# EAGLE design POIstick (EAGLE 8.3.2)
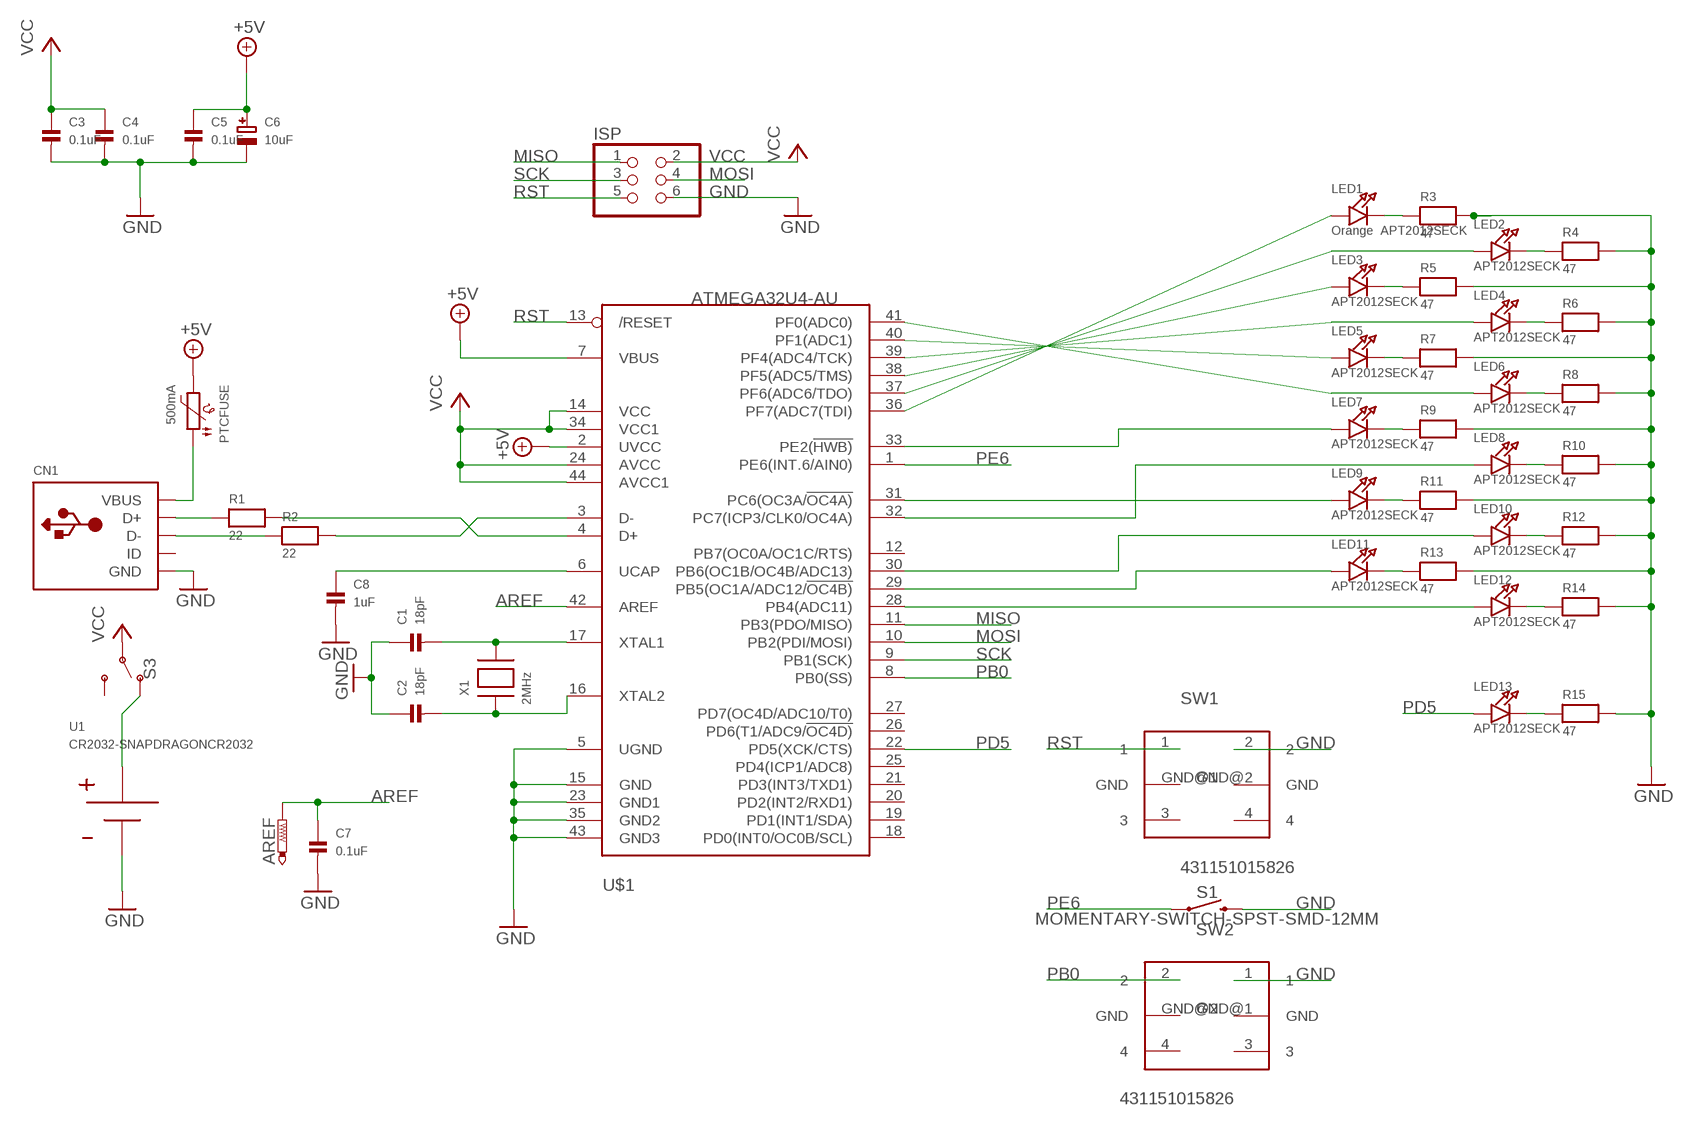
[diagram p0: schematic, sheet 1]

## Parts
AREF  PTR1B1,27  [B1,27]
C1  18pF  CAP_CERAMIC0805  [0805]
C2  18pF  CAP_CERAMIC0805  [0805]
C3  0.1uF  CAP_CERAMIC0805  [0805]
C4  0.1uF  CAP_CERAMIC0805  [0805]
C5  0.1uF  CAP_CERAMIC0805  [0805]
C6  10uF  CAP_TANTALUMA/3216_WAVE  [EIA3216-18/A-W]
C7  0.1uF  CAP_CERAMIC0805  [0805]
C8  1uF  CAP_CERAMIC0805  [0805]
CN1  USBMINIB  [USB-MINIB]
ISP  PINHD-2X3  [2X03]
LED1  Orange APT2012SECK  LED0805  [CHIPLED_0805]
LED2  APT2012SECK  LED0805  [CHIPLED_0805]
LED3  APT2012SECK  LED0805  [CHIPLED_0805]
LED4  APT2012SECK  LED0805  [CHIPLED_0805]
LED5  APT2012SECK  LED0805  [CHIPLED_0805]
LED6  APT2012SECK  LED0805  [CHIPLED_0805]
LED7  APT2012SECK  LED0805  [CHIPLED_0805]
LED8  APT2012SECK  LED0805  [CHIPLED_0805]
LED9  APT2012SECK  LED0805  [CHIPLED_0805]
LED10  APT2012SECK  LED0805  [CHIPLED_0805]
LED11  APT2012SECK  LED0805  [CHIPLED_0805]
LED12  APT2012SECK  LED0805  [CHIPLED_0805]
LED13  APT2012SECK  LED0805  [CHIPLED_0805]
PTCFUSE  500mA  PTC1206  [1206]
R1  22  RESISTOR0805  [0805]
R2  22  RESISTOR0805  [0805]
R3  47  RESISTOR0805  [0805]
R4  47  RESISTOR0805  [0805]
R5  47  RESISTOR0805  [0805]
R6  47  RESISTOR0805  [0805]
R7  47  RESISTOR0805  [0805]
R8  47  RESISTOR0805  [0805]
R9  47  RESISTOR0805  [0805]
R10  47  RESISTOR0805  [0805]
R11  47  RESISTOR0805  [0805]
R12  47  RESISTOR0805  [0805]
R13  47  RESISTOR0805  [0805]
R14  47  RESISTOR0805  [0805]
R15  47  RESISTOR0805  [0805]
S1  MOMENTARY-SWITCH-SPST-SMD-12MM  [TACTILE_SWITCH_SMD_12MM]
S3  SWITCH-SPDT-SMD-RIGHT-ANGLE  [SWITCH_SPST_SMD_A]
SW1  431151015826  [431181015816]
SW2  431151015826  [431181015816]
U1  CR2032-SNAPDRAGONCR2032  [CR2032-SNAPDRAGON]
U$1  ATMEGA32U4-AU  [TQFP44]
X1  2MHz  XTALNX5032  [NX5032]

## Nets
+5V: C5.1 C6.+ PTCFUSE.2 U$1.2(UVCC) U$1.7(VBUS)
AREF: AREF.TP C7.1 U$1.42(AREF)
GND: C1.1 C2.1 C3.2 C4.2 C5.2 C6.- C7.2 C8.2 CN1.GND ISP.6 R3.2 R4.2 R5.2 R6.2 R7.2 R8.2 R9.2 R10.2 R11.2 R12.2 R13.2 R14.2 R15.2 S1.3 SW1.2 SW2.1 U1.V- U$1.5(UGND) U$1.15(GND) U$1.23(GND1) U$1.35(GND2) U$1.43(GND3)
MISO: ISP.1 U$1.11(PB3(PDO/MISO))
MOSI: ISP.4 U$1.10(PB2(PDI/MOSI))
N$1: CN1.D+ R1.1
N$2: CN1.D- R2.1
N$3: R1.2 U$1.4(D+)
N$4: R2.2 U$1.3(D-)
N$5: CN1.VBUS PTCFUSE.1
N$6: C2.2 U$1.16(XTAL2) X1.P$1
N$7: C1.2 U$1.17(XTAL1) X1.P$2
N$8: LED1.C R3.1
N$9: LED2.A U$1.37(PF6(ADC6/TDO))
N$10: LED2.C R4.1
N$11: LED1.A U$1.36(PF7(ADC7(TDI))
N$12: LED3.C R5.1
N$13: LED3.A U$1.38(PF5(ADC5/TMS))
N$14: LED4.C R6.1
N$15: LED4.A U$1.39(PF4(ADC4/TCK))
N$16: LED5.C R7.1
N$17: LED5.A U$1.40(PF1(ADC1))
N$18: LED6.C R8.1
N$19: LED6.A U$1.41(PF0(ADC0))
N$20: LED7.C R9.1
N$21: LED7.A U$1.33(PE2(!HWB))
N$22: LED8.C R10.1
N$23: LED8.A U$1.32(PC7(ICP3/CLK0/OC4A))
N$24: LED9.C R11.1
N$25: LED9.A U$1.31(PC6(OC3A/!OC4A))
N$26: LED10.C R12.1
N$27: LED10.A U$1.30(PB6(OC1B/OC4B/ADC13))
N$28: LED11.C R13.1
N$29: LED11.A U$1.29(PB5(OC1A/ADC12/!OC4B))
N$30: LED12.C R14.1
N$31: LED12.A U$1.28(PB4(ADC11))
N$32: LED13.C R15.1
N$33: S3.1(O) U1.V+
N$34: C8.1 U$1.6(UCAP)
PB0: SW2.2 U$1.8(PB0(SS))
PD5: LED13.A U$1.22(PD5(XCK/CTS))
PE6: S1.1 U$1.1(PE6(INT.6/AIN0))
RST: ISP.5 SW1.1 U$1.13(/RESET)
SCK: ISP.3 U$1.9(PB1(SCK))
VCC: C3.1 C4.1 ISP.2 S3.2(P) U$1.14(VCC) U$1.24(AVCC) U$1.34(VCC1) U$1.44(AVCC1)
Unconnected: CN1.ID S3.3(S) SW1.3 SW1.4 SW1.GND@1(GND) SW1.GND@2(GND) SW2.3 SW2.4 SW2.GND@1(GND) SW2.GND@2(GND) U$1.12(PB7(OC0A/OC1C/RTS)) U$1.18(PD0(INT0/OC0B/SCL)) U$1.19(PD1(INT1/SDA)) U$1.20(PD2(INT2/RXD1)) U$1.21(PD3(INT3/TXD1)) U$1.25(PD4(ICP1/ADC8)) U$1.26(PD6(T1/ADC9/!OC4D)) U$1.27(PD7(OC4D/ADC10/T0))

## Library data of the parts
AREF = testpad:PTR1: TEST PIN
C1-C5 C7 C8 = microbuilder:CAP_CERAMIC: Ceramic Capacitors 0402 - 0402 Surface Mount Capacitors 16pF 50V 5% [Digikey: 445-4899-2-ND] 18pF 50V 5% [Digikey: 490-1281-2-ND] 22pF 50V 5% [Digikey: 490-1283-2-ND] 68pF 50V 5% [Digikey: 490-1289-2-ND] 0.1uF 10V 10% [Digikey: 490-1318-2-ND] 1.0uF 6.3V 10% [Digikey: 490-1320-2-ND] 0603 - 0603 Surface Mount Capacitors 16 pF 50V 5% [Digikey: 445-5051-2-ND] 22 pF 50V [Digikey: PCC220ACVTR-ND] 33 pF 50V 5% [Digikey: 490-1415-1-ND] 56pF 50V 5% [Digikey: 490-1421-1-ND] 220pF 50V 5% [Digikey: 445-1285-1-ND] 680 pF 50V 2200 pF 50V 5% C0G [Digikey: 445-1297-1-ND] 5600 pF 100V 5% X7R [Digikey: 478-3711-1-ND] 0.1 µF 25V 10% [Digikey: PCC2277TR-ND] 0.22 µF 16V 10% X7R [Digikey: 445-1318-1-ND] 1.0 µF 25V 10% [Digikey: 445-5146-2-ND] 0603 - RF Specific 3pF 250V +/-0.1pF RF [Digikey: 712-1347-1-ND] 18 pF 250V 5% [Digikey: 478-3505-1-ND or 712-1322-1-ND] 56 pF 250V 5% C0G RF [Digikey: 490-4867-1-ND] 68 pF 250V RF [Digikey: 490-4868-1-ND] 0805 - 0805 Surface Mount Capacitors 220 pF 250V 2% RF Ceramic Capacitor [Digikey: 712-1398-1-ND] 1000 pF 50V 2% NP0 Ceramic Capacitor [Digikey: 478-3760-1-ND] 0.1 µF 25V 10% Ceramic Capacitor [Digikey: PCC1828TR-ND] 1.0 µF 16V 10% Ceramic Capacitor[Digikey: 490-1691-2-ND] 10.0 µF 10V 10% Ceramic Capacitor[Digikey: 709-1228-1-ND] 10.0 uF 16V 10% Ceramic Capacitor [Digikey: 478-5165-2-ND] 47 uF 6.3V 20% Ceramic Capacitor [Digikey: 587-1779-1-ND or 399-5506-1-ND] 1206 - 1206 Surface Mount Capacitors 47uF 10V 20% Ceramic Capacitor [Digikey: 490-5528-1-ND or 399-5508-1-ND or 445-6010-1-ND]
C6 = microbuilder:CAP_TANTALUM: Tantalum Capacitors Wave footprints have larger pads and are meant to be used for hand soldering. Reflow footprints are optimised for solder paste and a reflow oven. EIA3216-18/A-[R/W] - Size A / 3216-18 / 1206 footprint 4.7µF 25V 10% Tantalum Capacitor 10µF 16V 10% Tantalum Capacitor [Digikey: 495-2236-2-ND] EIA3528-21/B-[R/W] - Size B / 3528-21 47µF 10V 10% Tantalum Capactior [Digikey: 495-2216-1-ND] EIA6032-28/C-[R/W] - Size C / 6032-28 10µF 35V 20% Tantalum Capacitor [Digikey: 495-2285-1-ND] 100µF 16V 10% Tantalum Capactior [Digikey: 399-5214-1-ND]
CN1 = adafruit:USB: USB Connectors USBMINIB - Surface Mount Female Mini-B USB Connector 4UConnector: 06564 By microbuilder.eu Thru-hole RA Female Mini-B USB Connector 4UConnector: 18732 By ladyada.net
ISP = pinhead:PINHD-2X3: PIN HEADER
LED1-LED13 = microbuilder:LED: LED 0603 - 0603 Surface Mount Package 2mA: Green LED - Low Power (3.9mcd, 2ma, 1.7Vf) - Digikey: 475-2709-2-ND Orange LED - Low Power (9.8mcd, 2ma, 1.8Vf) - Digikey: 475-1194-2-ND Red LED - Low Power (5mcd, 2ma, 1.8Vf) - Digikey: 475-1195-2-ND Yellow LED - Low Power (7mcd, 2ma, 1.8Vf) - Digikey: 475-1196-2-ND 5mA: Blue LED - Low Power (17mcd, 5ma, 2.9Vf) - Digikey: LNJ937W8CRACT-ND 0805 - 0805 Surface Mount Package 2mA: Red LED (8.8mcd, 2mA, 1.8Vf, Clear) - Low Power [Digikey: 475-2510-1-ND] Green LED (5mcd, 2mA, 1.8Vf, Clear) - Low Power [Digikey: 475-2730-1-ND] Yellow LED (11.3mcd, 2mA, 1.8Vf, Clear) - Low Power [Digikey: 475-2555-1-ND] 20mA: Red LED (104mcd, 20mA, Diffused) - LS R976 [Digikey: 475-1278-6-ND] Red LED (12mcd, 20mA, 2.0Vf, Clear) - APT2012EC [Digikey: 754-1128-1-ND] Green LED (15mcd, 20mA, 2.2Vf, Clear) - APT2012GC [Digikey: 754-1131-1-ND] Orange LED (160mcd, 20mA, 2.1Vf, Clear) - APT2012SECK [Digikey: 754-1130-1-ND] 1206 - 1206 Surface Mount Package Green LED (26mcd, 20mA, Diffused) - LG N971 [Digikey: 475-1407-6-ND] Red LED (15mcd, 20mA, Diffused) - LH N974 [Digikey: 475-1416-6-ND]
PTCFUSE = microbuilder:PTC: PTC (Resettable Fuse) 1206 Package 250mA PTC (16V Max, Time-to-Trip: 0.08s) - Digikey: F2110CT-ND 1210 Package 100mA PTC (30V Max, Time-to-Trip: 0.6s) - Digikey: MF-USMF010-2CT-ND 1812 Package 750mA PTC (24V Max, Time-to-Trip: 0.2s) - Digikey: MF-MSMF075/24-2CT-ND
R1-R15 = microbuilder:RESISTOR: Resistors 0402 - 0402 Surface Mount Package 22 Ohm 1% 1/16W [Digikey: 311-22.0LRTR-ND] 33 Ohm 5% 1/16W 1.0K 5% 1/16W 1.5K 5% 1/16W 2.0K 1% 1/16W 10.0K 1% 1/16W [Digikey: 311-10.0KLRTR-ND] 10.0K 5% 1/16W [Digikey: RMCF0402JT10K0TR-ND] 12.1K 1% 1/16W [Digikey: 311-22.0LRTR-ND] 100.0K 5% 1/16W 0603 - 0603 Surface Mount Package 0 Ohm 1/10 Watt 1% Resistor 15 Ohm 1/10 Watt 1% Resistor 33 Ohm 1/10 Watt 1% Resistor 49.9 Ohm 1/10 Watt 1% Resistor 100 Ohm 1/10 Watt 1% Resistor 150 Ohm 1/10 Watt 1% Resistor 240 Ohm 1/10 Watt 1% Resistor 390 Ohm 1/10 Watt 1% Resistor 560 Ohm 1/10 Watt 1% Resistor 680 Ohm 1/10 Watt 1% Resistor 750 Ohm 1/10 Watt 1% Resistor 1.0K Ohm 1/10 Watt 1% Resistor 1.5K Ohm 1/10 Watt 1% Resistor 2.0K Ohm 1/10 Watt 1% Resistor 2.2K Ohm 1/10 Watt 1% Resistor 3.3K Ohm 1/10 Watt 1% Resistor 4.7K Ohm 1/10 Watt 1% Resistor 10.0K Ohm 1/10 Watt 1% Resistor 12.0K Ohm 1/10 Watt 1% Resistor 12.1K Ohm 1/10 Watt 1% Resistor 20.0K Ohm 1/10 Watt 1% Resistor 33.0K Ohm 1/10 Watt 1% Resistor 100.0K Ohm 1/10 Watt 1% Resistor 0805 - 0805 Surface Mount Package 0 Ohm 1/8 Watt 1% Resistor 33 Ohm 1/8 Watt 1% Resistor 100 Ohm 1/8 Watt 1% Resistor 150 Ohm 1/8 Watt 1% Resistor 200 Ohm 1/8 Watt 1% Resistor 240 Ohm 1/8 Watt 1% Resistor 330 Ohm 1/8 Watt 1% Resistor 390 Ohm 1/8 Watt 1% Resistor 470 Ohm 1/8 Watt 1% Resistor 1.0K Ohm 1/8 Watt 1% Resistor 1.5K Ohm 1/8 Watt 1% Resistor 2.0K Ohm 1/8 Watt 1% Resistor 4.7K Ohm 1/8 Watt 1% Resistor 5.1K Ohm 1/8 Watt 1% Resistor 5.6K Ohm 1/8 Watt 1% Resistor 10.0K Ohm 1/8 Watt 1% Resistor 22.0K Ohm 1/8 Watt 1% Resistor 33.0K Ohm 1/8 Watt 1% Resistor 100K Ohm 1/8 Watt 1% Resistor 1206 - 1206 Surface Mount Package 2012 - 2010 Surface Mount Package 0.11 Ohm 1/2 Watt 1% Resistor - Digikey: RHM.11UCT-ND
S1 = SparkFun-Switches:MOMENTARY-SWITCH-SPST: Momentary Switch (Pushbutton) - SPST Normally-open (NO) SPST momentary switches (buttons, pushbuttons). Variants PTH-12MM - 12mm square, through-hole Momentary Pushbutton Switch - 12mm Square <https://www.sparkfun.com/products/9190> (COM-09190) PTH-6.0MM, PTH-6.0MM-KIT - 6.0mm square, through-hole Mini Pushbutton Switch <https://www.sparkfun.com/products/97> (COM-00097) KIT package intended for soldering kit's - only one side of pads' copper is exposed. PTH-RIGHT-ANGLE-KIT - Right-angle, through-hole Right Angle Tactile Button <https://www.sparkfun.com/products/10791> - Used on SparkFun BigTime Watch Kit <https://www.sparkfun.com/products/11734> SMD-12MM - 12mm square, surface-mount Tactile Button - SMD (12mm) <https://www.sparkfun.com/products/12993> (COM-12993) Used on SparkFun PicoBoard <https://www.sparkfun.com/products/11888> SMD-4.5MM - 4.5mm Square Trackball Switch Used on SparkFun Blackberry Trackballer Breakout <https://www.sparkfun.com/products/13169> SMD-4.6MMX2.8MM - 4.60mm x 2.80mm, surface mount Used on SparkFun SAMD21 Mini Breakout <https://www.sparkfun.com/products/13664> SMD-5.2MM, SMD-5.2-REDUNDANT - 5.2mm square, surface-mount Mini Pushbutton Switch - SMD <https://www.sparkfun.com/products/8720> (COM-08720) Used on Arduino Pro Mini <https://www.sparkfun.com/products/11114> REDUNDANT package connects both switch circuits together SMD-6.0X3.5MM - 6.0 x 3.5mm, surface mount Momentary Reset Switch SMD <https://www.sparkfun.com/products/8229> (COM-08229) SMD-6.2MM-TALL - 6.2mm square, surface mount Tactile Button - SMD (6mm) <https://www.sparkfun.com/products/12992> Used on SparkFun Digital Sandbox <https://www.sparkfun.com/products/12651> SMD-RIGHT-ANGLE - Right-angle, surface mount Used on SparkFun Block for Intel® Edison - Arduino <https://www.sparkfun.com/products/13036>; PROD_ID: SWCH-11967; SF_SKU: COM-12993
S3 = SparkFun-Switches:SWITCH-SPDT: Single Pole, Double Throw (SPDT) Switch Single-pole, double-throw (SPDT) switch. Variant Overview SMD-AYZ0202 Surface Mount DPDT Switch <https://www.sparkfun.com/products/597> (COM-00597) Used on e.g. LilyPad Arduino USB - ATmega32U4 Board <https://www.sparkfun.com/products/12049> PTH-11.6X4.0MM SPDT Mini Power Switch <https://www.sparkfun.com/products/102> (COM-00102) Used on e.g. SparkFun Simon Says - Through-Hole Soldering Kit <https://www.sparkfun.com/products/10547> (KIT-10547) PTH-11.6X4.0MM-KIT KIT version of SPDT Mini Power Switch - Simplifies soldering by removing tStop of switch pins - only one side can be soldered. PTH-11.6X4.0MM-LOCK LOCK version of SPDT Mini Power Switch - Offset pins hold switch in place for easier soldering. SMD-RIGHT-ANGLE Surface Mount Right Angle Switch <https://www.sparkfun.com/products/10860> (COM-10860) Used on e.g. SparkFun ESP8266 Thing <https://www.sparkfun.com/products/13231>; PROD_ID: SWCH-10651; SF_SKU: COM-10860
SW1 SW2 = Wurth_Elektronik_Electromechanic_Switchs_rev15b:431151015826: WS-TSS-5x5 mm SMD Tact Switch with ground terminal, 4 pins
U1 = CR2032-SnapDragon:CR2032-SNAPDRAGON: HOLDER SNAP DRAGON CR2032 SMD Digikey P/N: BHSD-2032-SMCT-ND
U$1 = adafruit:ATMEGA32U4: http://www.ladyada.net/library/eagle
X1 = adafruit:XTAL: Low cost SMT crystals, no capacitors included http://www.ladyada.net/library/eagle

## Board
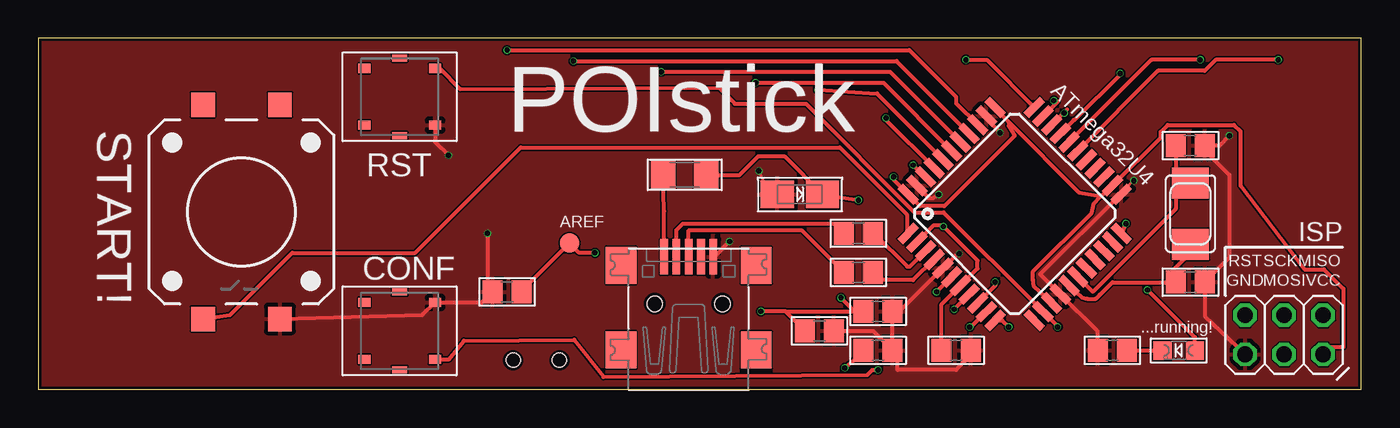
[diagram p1: board, top side]
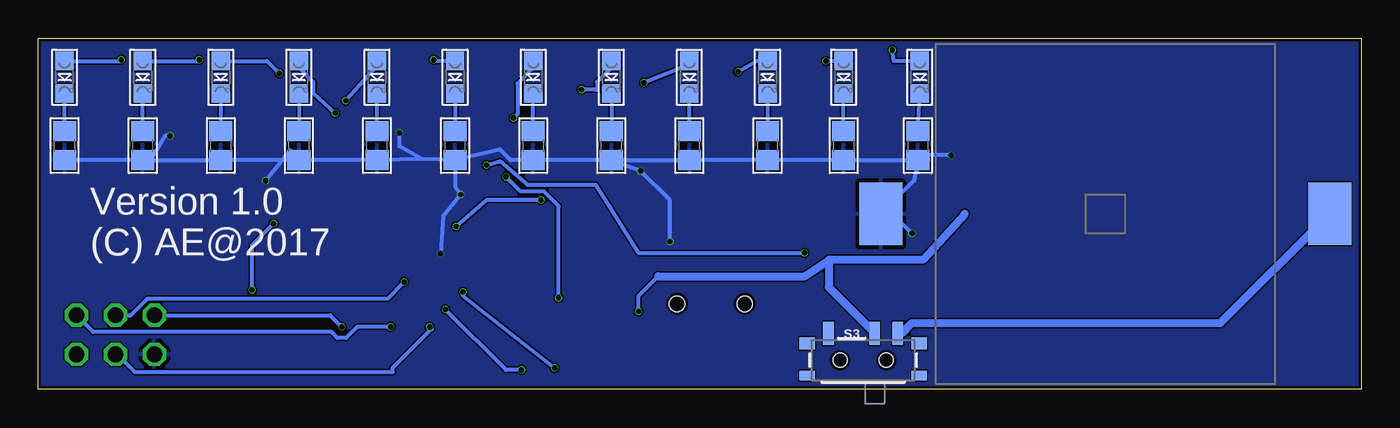
[diagram p2: board, bottom side, seen from below]

Size 86.03 x 22.85 mm. Coordinates in mm from the lower left corner, seen from the top.
Outline: 0,0 86.03,0 86.03,22.85 0,22.85 0,0
Copper layers (1*16): Top 0.035mm / dielectric 1.5mm / Bottom 0.035mm
Design rules "aisler_go_2layer": minimum track width 0.1mm, minimum drill 0.2mm, track to track 0.1mm, track to pad 0.1mm, pad to pad 0.1mm, via to via 0.1mm, smd to smd 0.1mm, copper to edge 0.2mm, drill to drill 0.21mm, minimum pad ring 0.25mm, minimum via ring 0.05mm, stop-mask expansion 0.01mm, vias tented up to drill 0mil, thermal gap 10mil

### Footprints (pad centres in the part's own frame; a part is rotated, then mirrored left to right if it is on the bottom)
B1,27 = smd 1.27 x 1.27: TP 0,0
0805 = smd 1.3 x 1.5: 1 -0.95,0; 2 0.95,0
EIA3216-18/A-W = smd 2.15 x 1.8: + 1.475,0; - -1.475,0
USB-MINIB = smd 0.5 x 2.308: D+ 0,4.064; D- -0.8,4.064; GND 1.6,4.064; ID 0.8,4.064; VBUS -1.6,4.064 | smd 2 x 2.4: GND1 -4.4,-2; GND2 -4.4,3.5; GND3 4.4,3.5; GND4 4.4,-2 | hole 1: -2.2,1; 2.2,1
2X03 = drill 1.016 octagon: 1 -2.54,-1.27; 2 -2.54,1.27; 3 0,-1.27; 4 0,1.27; 5 2.54,-1.27; 6 2.54,1.27
CHIPLED_0805 = smd 1.2 x 1.2: A 0,-1.05; C 0,1.05
1206 = smd 1.6 x 1.8: 1 -1.4,0; 2 1.4,0
TACTILE_SWITCH_SMD_12MM = smd 1.6 x 1.55: 1 6.975,-2.5; 2 -6.975,-2.5; 3 6.975,2.5; 4 -6.975,2.5
SWITCH_SPST_SMD_A = smd 0.7 x 1.5: 1 -2.25,-1.75; 2 -0.75,-1.75; 3 2.25,-1.75 | smd 1 x 0.6: GND1 -3.65,1; GND3 3.65,1 | smd 1 x 0.8: GND2 -3.65,-1.1; GND4 3.65,-1.1 | hole 0.9: -1.5,0; 1.5,0
431181015816 = smd 0.8 x 0.6: 1 -2.3,-1.85; 2 -2.3,1.85; 3 2.3,-1.85; 4 2.3,1.85 | smd 1 x 0.45: GND@1 0,-2.525; GND@2 0,2.525
CR2032-SNAPDRAGON = smd 2.794 x 4.064: V+ 14.605,0; V- -14.605,0
TQFP44 = smd 1.5 x 0.5: 1 -5.8,4; 2 -5.8,3.2; 3 -5.8,2.4; 4 -5.8,1.6; 5 -5.8,0.8; 6 -5.8,0; 7 -5.8,-0.8; 8 -5.8,-1.6; 9 -5.8,-2.4; 10 -5.8,-3.2; 11 -5.8,-4; 23 5.8,-4; 24 5.8,-3.2; 25 5.8,-2.4; 26 5.8,-1.6; 27 5.8,-0.8; 28 5.8,0; 29 5.8,0.8; 30 5.8,1.6; 31 5.8,2.4; 32 5.8,3.2; 33 5.8,4 | smd 0.5 x 1.5: 12 -4,-5.8; 13 -3.2,-5.8; 14 -2.4,-5.8; 15 -1.6,-5.8; 16 -0.8,-5.8; 17 0,-5.8; 18 0.8,-5.8; 19 1.6,-5.8; 20 2.4,-5.8; 21 3.2,-5.8; 22 4,-5.8; 34 4,5.8; 35 3.2,5.8; 36 2.4,5.8; 37 1.6,5.8; 38 0.8,5.8; 39 0,5.8; 40 -0.8,5.8; 41 -1.6,5.8; 42 -2.4,5.8; 43 -3.2,5.8; 44 -4,5.8
NX5032 = smd 2 x 2.4: P$1 2,0; P$2 -2,0

### Placement (x,y rotation side)
AREF  34.54,9.52 0 top
C1  74.93,15.88 180 top
C2  74.93,6.99 180 top
C3  54.61,5.08 0 top
C4  50.8,3.81 0 top
C5  59.69,2.54 0 top
C6  49.53,12.7 0 top
C7  30.48,6.35 180 top
C8  54.61,2.54 0 top
CN1  42.29,4.57 0 top
ISP  81.03,3.56 180 top
LED1  28.7,20.32 180 bottom
LED2  33.66,20.32 180 bottom
LED3  38.61,20.32 180 bottom
LED4  43.69,20.32 180 bottom
LED5  48.77,20.32 180 bottom
LED6  53.85,20.32 180 bottom
LED7  58.93,20.32 180 bottom
LED8  64.01,20.32 180 bottom
LED9  69.09,20.32 180 bottom
LED10  74.17,20.32 180 bottom
LED11  79.25,20.32 180 bottom
LED12  84.33,20.32 180 bottom
LED13  74.17,2.54 90 top
PTCFUSE  42.04,13.97 0 top
R1  53.34,7.62 0 top
R2  53.34,10.16 0 top
R3  28.83,15.88 270 bottom
R4  33.66,15.88 270 bottom
R5  38.61,15.88 270 bottom
R6  43.69,15.88 270 bottom
R7  48.77,15.88 270 bottom
R8  53.85,15.88 270 bottom
R9  58.93,15.88 270 bottom
R10  64.01,15.88 270 bottom
R11  69.09,15.88 270 bottom
R12  74.17,15.88 270 bottom
R13  79.25,15.88 270 bottom
R14  84.33,15.88 270 bottom
R15  69.85,2.54 180 top
S1  13.21,11.56 270 top
S3  32.38,1.91 180 bottom
SW1  23.5,19.05 180 top
SW2  23.5,3.81 180 top
U1  16.64,11.43 0 bottom
U$1  63.5,11.43 45 top
X1  74.93,11.43 270 top

### Tracks (layer width: path | path; a pad name or v marks a point on that pad's centre or on a via)
+5V  (via drill 0.35)
  Top 0.254: U$1.2 58.21,10.67 58.8,10.67 v58.86,10.6 61.09,8.38 61.09,7.87 59.98,6.76 U$1.7 58.74,5.54 C5.1 | PTCFUSE.2 45.61,13.97 46.82,15.19 48.52,15.19 C6.+ v53.34,12.32
  Bottom 0.254: v53.34,12.32 56.9,12.32 v58.86,10.6
AREF  (via drill 0.35)
  Top 0.254: C7.1 31.43,6.41 AREF.TP 35.18,8.89 v36.2,8.89 | U$1.42 57.67,13.83 v56.9,14.6
  Bottom 0.254: v36.2,8.89 46.99,8.89 48.84,11.85 | 48.84,11.85 48.9,11.94 | v56.9,14.6 56.01,14.86 54.23,13.34 49.78,13.34 48.84,11.85
GND  (via drill 0.35)
  Top 0.152: v71.25,13.59 71.19,13.59 U$1.23 | v46.86,14.22 47.12,13.64 C6.-
  Top 0.254: U$1.23 70.36,12.7 65.15,7.49 65.17,7.49 U$1.15 68.9,3.77 R15.2 | U$1.35 61.66,17.6 v62.56,16.71 | v59.89,8.83 59.63,8.7 U$1.5 56.02,5.08 C3.2 C8.2 | v77.47,16.51 76.84,15.88 C1.1 75.88,15.56 77.47,13.97 77.47,8.57 C2.1 75.88,4.77 ISP.6 | CN1.GND 43.97,8.64 v44.96,9.63 | C4.2 54.29,3.81 C8.2 | C5.2 60.64,2.22 59.69,1.27 55.88,1.27 55.88,2.22 C8.2 | U$1.43 57.14,13.22 57.91,12.45 58.2,12.45 v58.56,12.68 | S1.3 24.97,4.84 SW2.1 28.84,5.66 C7.2 29.21,6.67 v29.21,10.16 | SW1.2 25.8,16.12 v26.67,15.24
  Bottom 0.152: R11.2 69.66,15.56 | R7.2 48.2,15.56
  Bottom 0.254: R7.2 R6.2 R5.2 R4.2 R3.2 | R7.2 R8.2 55.31,14.93 56.01,15.62 R9.2 | R9.2 61.09,15 | 61.09,15 R10.2 R11.2 R12.2 78.74,14.93 | 78.74,14.93 R13.2 R14.2 | v62.56,16.71 62.56,15.84 61.09,15 | v59.89,8.83 59.7,11.3 v58.56,12.68 58.93,13.18 R9.2 | 69.66,15.56 v71.25,13.59 | v77.47,16.51 77.79,16.51 78.74,14.93 | v44.96,9.63 44.96,12.32 v46.86,14.22 48.7,14.86 R7.2 | v26.67,15.24 28.76,15.24 R3.2 | R3.2 29.08,13.59 U1.V- 30.48,11.43 v29.21,10.16
  pour Top: -1.27,24.13 87.63,24.13 87.63,-1.27 -1.27,-1.27
  pour Bottom: -1.78,24.77 -1.78,-1.91 88.52,-1.91 88.52,24.77
MISO  (via drill 0.35)
  Top 0.254: U$1.11 62.68,4.5 v63.12,4.06
  Bottom 0.254: v63.12,4.06 65.29,4.06 66,3.36 66.59,3.36 66.97,3.73 82.47,3.73 ISP.1
MOSI  (via drill 0.35)
  Top 0.254: v60.58,4.06 60.66,4.06 U$1.10
  Bottom 0.254: ISP.4 80.9,2.29 79.76,1.14 62.99,1.14 62.99,1.4 60.45,3.94 v60.58,4.06
N$1
  Top 0.254: CN1.D+ 42.29,10.34 49.67,10.34 R1.1
N$2
  Top 0.254: CN1.D- 41.49,10.38 41.91,10.79 51.75,10.79 R2.1
N$3
  Top 0.254: U$1.4 58.24,8.46 56.9,7.11 54.8,7.11 R1.2
N$4
  Top 0.254: R2.2 54.36,10.16 56.52,8 56.68,8 U$1.3
N$5
  Top 0.254: CN1.VBUS 40.69,11.61 PTCFUSE.1
N$6
  Top 0.254: X1.P$1 74.93,8.89 73.66,7.62 73.66,7.3 C2.2 69.86,6.98 69.04,6.16 | U$1.16 67.85,6 68.22,5.89 68.77,5.89 69.04,6.16 | 69.04,6.16
N$7
  Top 0.254: C1.2 73.98,14.38 | 73.98,14.38 X1.P$2 | 73.98,14.38 73.98,11.75 68.58,6.35 | 68.58,6.35 | 68.58,6.35 U$1.17
N$8
  Bottom 0.254: R3.1 LED1.C
N$9  (via drill 0.35)
  Top 0.254: v34.8,21.38 55.81,21.38 U$1.37
  Bottom 0.254: LED2.A 34.91,21.37 v34.8,21.38
N$10
  Bottom 0.254: R4.1 LED2.C
N$11  (via drill 0.35)
  Top 0.254: v30.48,22.09 56.65,22.09 59.69,19.05 59.69,18.63 U$1.36
  Bottom 0.254: LED1.A 30.39,21.37 v30.48,22.09
N$12
  Bottom 0.254: LED3.C R5.1
N$13  (via drill 0.35)
  Top 0.254: v40.51,20.67 55.39,20.67 U$1.38
  Bottom 0.254: LED3.A 39.31,21.37 v40.51,20.67
N$14
  Bottom 0.254: R6.1 LED4.C
N$15  (via drill 0.35)
  Top 0.254: v46.65,19.97 54.96,19.97 U$1.39
  Bottom 0.254: LED4.A 43.69,21.15 v46.65,19.97
N$16
  Bottom 0.254: LED5.C R7.1
N$17  (via drill 0.35)
  Top 0.254: v50.71,19.51 54.54,19.26 U$1.40
  Bottom 0.254: v50.71,19.51 49.7,19.51 49.7,20.01 48.77,20.94 LED5.A
N$18
  Bottom 0.254: R8.1 LED6.C
N$19  (via drill 0.35)
  Top 0.254: v55.13,17.67 55.13,17.54 U$1.41
  Bottom 0.254: v55.13,17.67 54.88,17.92 54.88,19.91 53.85,20.94 LED6.A
N$20
  Bottom 0.254: LED7.C R9.1
N$21  (via drill 0.35)
  Top 0.254: v60.33,21.46 61.68,21.46 U$1.33
  Bottom 0.254: LED7.A 60.24,21.37 v60.33,21.46
N$22
  Bottom 0.254: R10.1 LED8.C
N$23  (via drill 0.35)
  Top 0.254: v66.04,18.8 66.29,18.75 U$1.32
  Bottom 0.254: LED8.A 64.01,21.08 v66.04,18.8
N$24
  Bottom 0.254: LED9.C R11.1
N$25  (via drill 0.35)
  Top 0.254: v66.72,17.99 66.92,18.24 U$1.31
  Bottom 0.254: v66.72,17.99 68.16,19.3 68.16,20.01 69.09,20.94 LED9.A
N$26
  Bottom 0.254: LED10.C R12.1
N$27  (via drill 0.35)
  Top 0.254: U$1.30 67.34,17.54 67.39,17.54 70.36,20.5 v70.36,20.57
  Bottom 0.254: LED10.A 71.15,21.37 v70.36,20.57
N$28
  Bottom 0.254: R13.1 LED11.C
N$29  (via drill 0.35)
  Top 0.254: v75.56,21.46 72.39,21.46 U$1.29
  Bottom 0.254: LED11.A 75.65,21.37 v75.56,21.46
N$30
  Bottom 0.254: R14.1 LED12.C
N$31  (via drill 0.35)
  Top 0.254: v80.64,21.46 76.57,21.46 75.86,20.75 72.82,20.75 U$1.28
  Bottom 0.254: LED12.A 80.73,21.37 v80.64,21.46
N$32
  Top 0.254: R15.1 LED13.C
N$33
  Bottom 0.508: S3.1 29.87,3.66 29.21,4.32 9.14,4.32 U1.V+
N$34  (via drill 0.35)
  Top 0.254: U$1.6 v58.42,6.35 | v52.45,1.39 53.72,2.48 C8.1
  Bottom 0.254: v58.42,6.35 58.42,6.09 v52.45,1.39
PB0  (via drill 0.35)
  Top 0.254: SW2.2 26.73,1.96 27.69,3.18 34.84,3.23 36.75,0.82 53.91,0.94 54.24,1.27 v54.61,1.27 | v59.56,5.21 59.56,5.23 U$1.8
  Bottom 0.254: v54.61,1.27 55.63,1.27 v59.56,5.21
PD5  (via drill 0.35)
  Top 0.254: LED13.A 75.22,3.4 v72.14,6.48 | v70.74,10.79 U$1.22
  Bottom 0.254: v72.14,6.48 72.14,9.4 v70.74,10.79
PE6
  Top 0.254: U$1.1 56.48,10.25 56.48,11.4 52.13,15.75 31.37,15.75 24.51,8.89 16.51,8.89 12.46,4.84 S1.1
RST  (via drill 0.35)
  Top 0.152: 65.05,5.36 U$1.13
  Top 0.254: SW1.1 26.09,20.9 27.43,19.56 44.27,19.63 45.3,18.6 49.93,18.6 56.99,11.53 58.87,11.53 65.05,5.36 66.29,4.11 v66.29,4.06
  Bottom 0.254: ISP.5 67.06,4.83 v66.29,4.06
SCK  (via drill 0.35)
  Top 0.254: v62.23,6.99 62.23,6.77 U$1.9
  Bottom 0.254: ISP.3 80.03,4.83 78.94,5.92 63.3,5.92 v62.23,6.99
VCC  (via drill 0.35)
  Top 0.254: U$1.34 62.23,18.29 63.12,17.4 | 63.12,17.4 63.12,17.15 63.5,16.51 58.93,11.94 57.34,11.94 U$1.44 55.62,13.65 v55.62,13.84 | 69.08,12.54 69.17,12.63 U$1.24 73,16.4 73,16.76 73.46,17.22 77.76,17.22 78.18,16.8 78.18,13.26 82.35,7.82 83.62,7.82 84.89,6.55 84.89,2.74 84.02,2.74 ISP.2 | 69.08,12.54 67.72,12.8 63.12,17.4 | U$1.14 64.76,6.7 64.69,7.15 64.69,7.68 68.51,11.5 68.64,12.1 69.08,12.54 | 48.58,5.08 v46.99,5.08 | 48.58,5.08 C4.1 | 48.58,5.08 C3.1 53.09,5.08 v52.2,5.97
  Bottom 0.254: v52.2,5.97 52.2,11.92 53.16,12.88 | 53.16,12.88 53.17,12.9 | v46.99,5.08 46.99,6.1 45.72,7.37 | 53.16,12.88 54.67,12.88 v55.62,13.84
  Bottom 0.508: 34.62,8.43 36.2,7.37 45.72,7.37 | 25.77,11.43 28.51,8.43 34.62,8.43 | 34.62,8.43 34.62,6.64 S3.2

### Text on the board
tNames: START! | POIstick | ATmega32U4 | RST | RST | SCK | MISO | CONF | GND | MOSI | VCC | ...running!
bNames: Version 1.0 / (C) AE@2017